# Altium schematic sheet ESP32_CAN_V2-power.SchDoc: ESP32_CAN_V2 - Power unit
size A4; DrawnBy: Balazs Finaczy, Laszlo Goczan; SheetNumber: 5; SheetTotal: 6
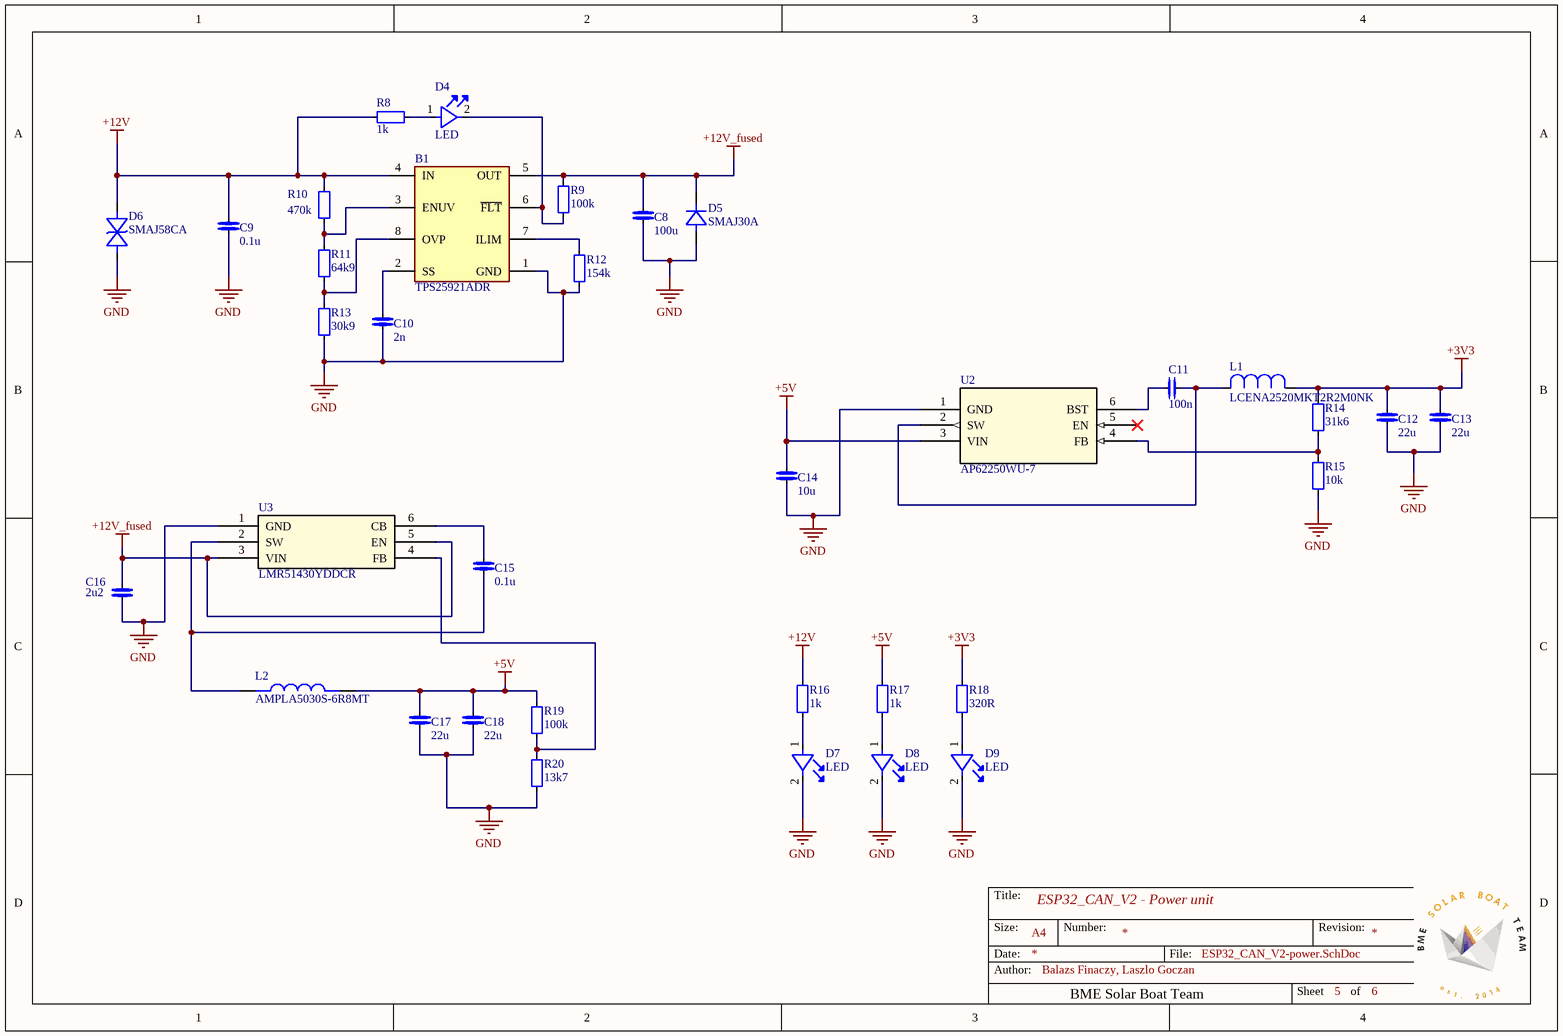
[diagram p0: ESP32_CAN_V2-power.SchDoc]

## Parts
B1  TPS25921ADR  [SOIC127P600X175-8N]
C8  100u  [C1206]
C9  0.1u  [C0603]
C10  2n  [C0603]
C11  100n  [C0603]
C12  22u  [C0805]
C13  22u  [C0805]
C14  10u  [C0805]
C15  0.1u  [C0603]
C16  2u2  [C0805]
C17  22u  [C0805]
C18  22u  [C0805]
D4  LED  [LED]
D5  SMAJ30A  [SMASeries_LTF]
D6  SMAJ58CA  [SMASeries_LTF]
D7  LED  [LED]
D8  LED  [LED]
D9  LED  [LED]
L1  LCENA2520MKT2R2M0NK  [IND_LCEN_2520MK_TAY]
L2  AMPLA5030S-6R8MT  [IND_AMPLA5030S-6R8MT]
R8  1k  [R0603]
R9  100k  [R0603]
R10  470k  [R0603]
R11  64k9  [R0603]
R12  154k  [R0603]
R13  30k9  [R0603]
R14  31k6  [R0603]
R15  10k  [R0603]
R16  1k  [R0603]
R17  1k  [R0603]
R18  320R  [R0603]
R19  100k  [R0603]
R20  13k7  [R0603]
U2  AP62250WU-7  [TSOT26STANDARD_DIO]
U3  LMR51430YDDCR  [SOT-23-THIN-6_DDC_TEX]

## Nets
+3V3: C12.2 C13.2 L1.1 R14.2 R18.2
+5V: C14.2 C17.2 C18.2 L2.2 R17.2 R19.2 U2.3(VIN)
+12V: B1.4(IN) C9.2 D6.1 R8.2 R10.2 R16.2
+12V_fused: B1.5(OUT) C8.2 C16.2 D5.1 R9.2 U3.3(VIN) U3.5(EN)
GND: B1.1(GND) C8.1 C9.1 C10.1 C12.1 C13.1 C14.1 C16.1 C17.1 C18.1 D5.2 D6.2 D7.2 D8.2 D9.2 R12.1 R13.1 R15.1 R20.1 U2.1(GND) U3.1(GND)
NetB1_2: B1.2(SS) C10.2
NetB1_3: B1.3(ENUV) R10.1 R11.2
NetB1_6: B1.6(~{FLT}) D4.2 R9.1
NetB1_7: B1.7(ILIM) R12.2
NetB1_8: B1.8(OVP) R11.1 R13.2
NetC11_1: C11.1 U2.6(BST)
NetC11_2: C11.2 L1.2 U2.2(SW)
NetC15_1: C15.1 L2.1 U3.2(SW)
NetC15_2: C15.2 U3.6(CB)
NetD4_1: D4.1 R8.1
NetD7_1: D7.1 R16.1
NetD8_1: D8.1 R17.1
NetD9_1: D9.1 R18.1
NetR14_1: R14.1 R15.2 U2.4(FB)
NetR19_1: R19.1 R20.2 U3.4(FB)

Not connected (* = marked no-connect by the designer): U2 5(EN)*

## Notes on the sheet
- Title:
- Size:
- Date:
- Author:
- A4
- Number:
- BME Solar Boat Team
- File:
- Revision:
- Sheet
- of

## Library data of the parts
B1 = TPS25921ADR: 18V, 1.6A, 90m eFuse with Adjustable +/-2% Accurate Current Limit; Manufacturer_Name: Texas Instruments; Geometry.Height: 1.75mm; Mouser Part Number: 595-TPS25921ADR; Mouser Price/Stock: https://www.mouser.co.uk/ProductDetail/Texas-Instruments/TPS25921ADR?qs=m%2F7bTylgptfvwfVPRm0ALQ%3D%3D; Manufacturer_Part_Number: TPS25921ADR; Datasheet Link: http://www.ti.com/lit/gpn/tps25921a
C8-C18 = C
D4 = LED: 150060RS83000
D5 = SMAJ30A: No Description Available; Manufacturer_Name: Littelfuse Inc; Copyright: Copyright (C) 2026 Ultra Librarian. All rights reserved.; Manufacturer_Part_Number: SMAJ30A
D6 = SMAJ58CA: No Description Available; Manufacturer_Name: Littelfuse Inc; Copyright: Copyright (C) 2026 Ultra Librarian. All rights reserved.; Manufacturer_Part_Number: SMAJ58CA
D7 = LED: 150060AS83000; Manufacturer_Part_Number: 710-150060AS83000
D8 = LED: 150060YS83000; Manufacturer_Part_Number: 710-150060YS83000
D9 = LED: 150060VS83000; Manufacturer_Part_Number: 710-150060VS83000
L1 = L: No Description Available; Manufacturer_Name: TAIYO YUDEN; Copyright: Copyright (C) 2026 Ultra Librarian. All rights reserved.; Manufacturer_Part_Number: LCENA2520MKT2R2M0NK
L2 = AMPLA5030S-6R8MT: Inductor Power Shielded/Molded Wirewound 6.8uH 20% 100KHz Carbonyl Powder 4A 0.0762Ohm DCR 2220 T/R; MF: Abracon LLC; Package: Package; Price: None; Value: *; SnapEDA_Link: https://www.snapeda.com/parts/AMPLA5030S-6R8MT/Abracon+LLC/view-part/?ref=snap; MP: AMPLA5030S-6R8MT; Availability: Unavailable; Check_prices: https://www.snapeda.com/parts/AMPLA5030S-6R8MT/Abracon+LLC/view-part/?ref=eda
R8-R20 = R
U2 = AP62250WU-7: No Description Available; Manufacturer_Name: Diodes Inc; Copyright: Copyright (C) 2026 Ultra Librarian. All rights reserved.; Manufacturer_Part_Number: AP62250WU-7; RefDes: RefDes; Type: Type
U3 = LMR51430YDDCR: SIMPLE SWITCHER&reg; 4.5-V to 36-V, 3-A synchronous buck converter with 40-&micro;A IQ 6-SOT-23-THIN -40 to 150; Manufacturer_Name: Texas Instruments; Copyright: Copyright (C) 2025 Ultra Librarian. All rights reserved.; Manufacturer_Part_Number: LMR51430YDDCR; RefDes: RefDes; Type: Type